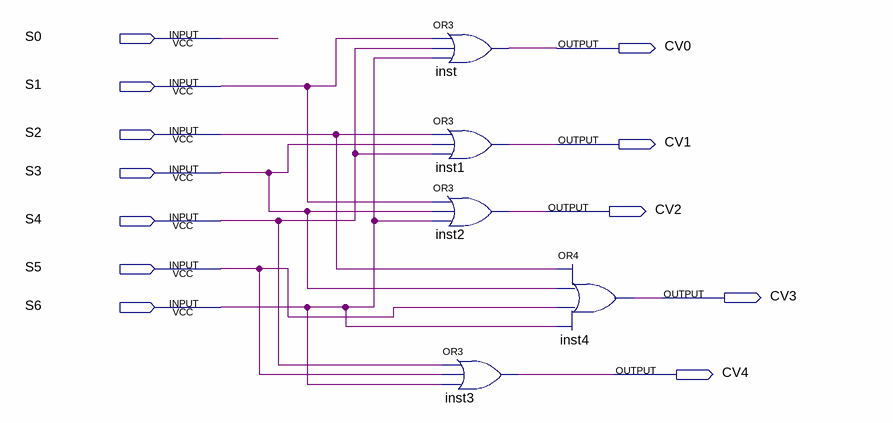
[diagram p0: schematic sheet]
// Quartus schematic CVOutG.bdf as structural Verilog: 5 symbols, 12 pins
module CVOutG (
  input  S0,
  input  S1,
  input  S2,
  input  S3,
  input  S4,
  input  S5,
  input  S6,
  output CV0,
  output CV1,
  output CV2,
  output CV3,
  output CV4
);

  or inst (CV0, S1, S4, S6);
  or inst1 (CV1, S2, S3, S4);
  or inst2 (CV2, S1, S3, S6);
  or inst3 (CV4, S4, S5, S6);
  or inst4 (CV3, S2, S3, S5, S6);
endmodule
